# EAGLE design stereomix-back (EAGLE 9.0.1)
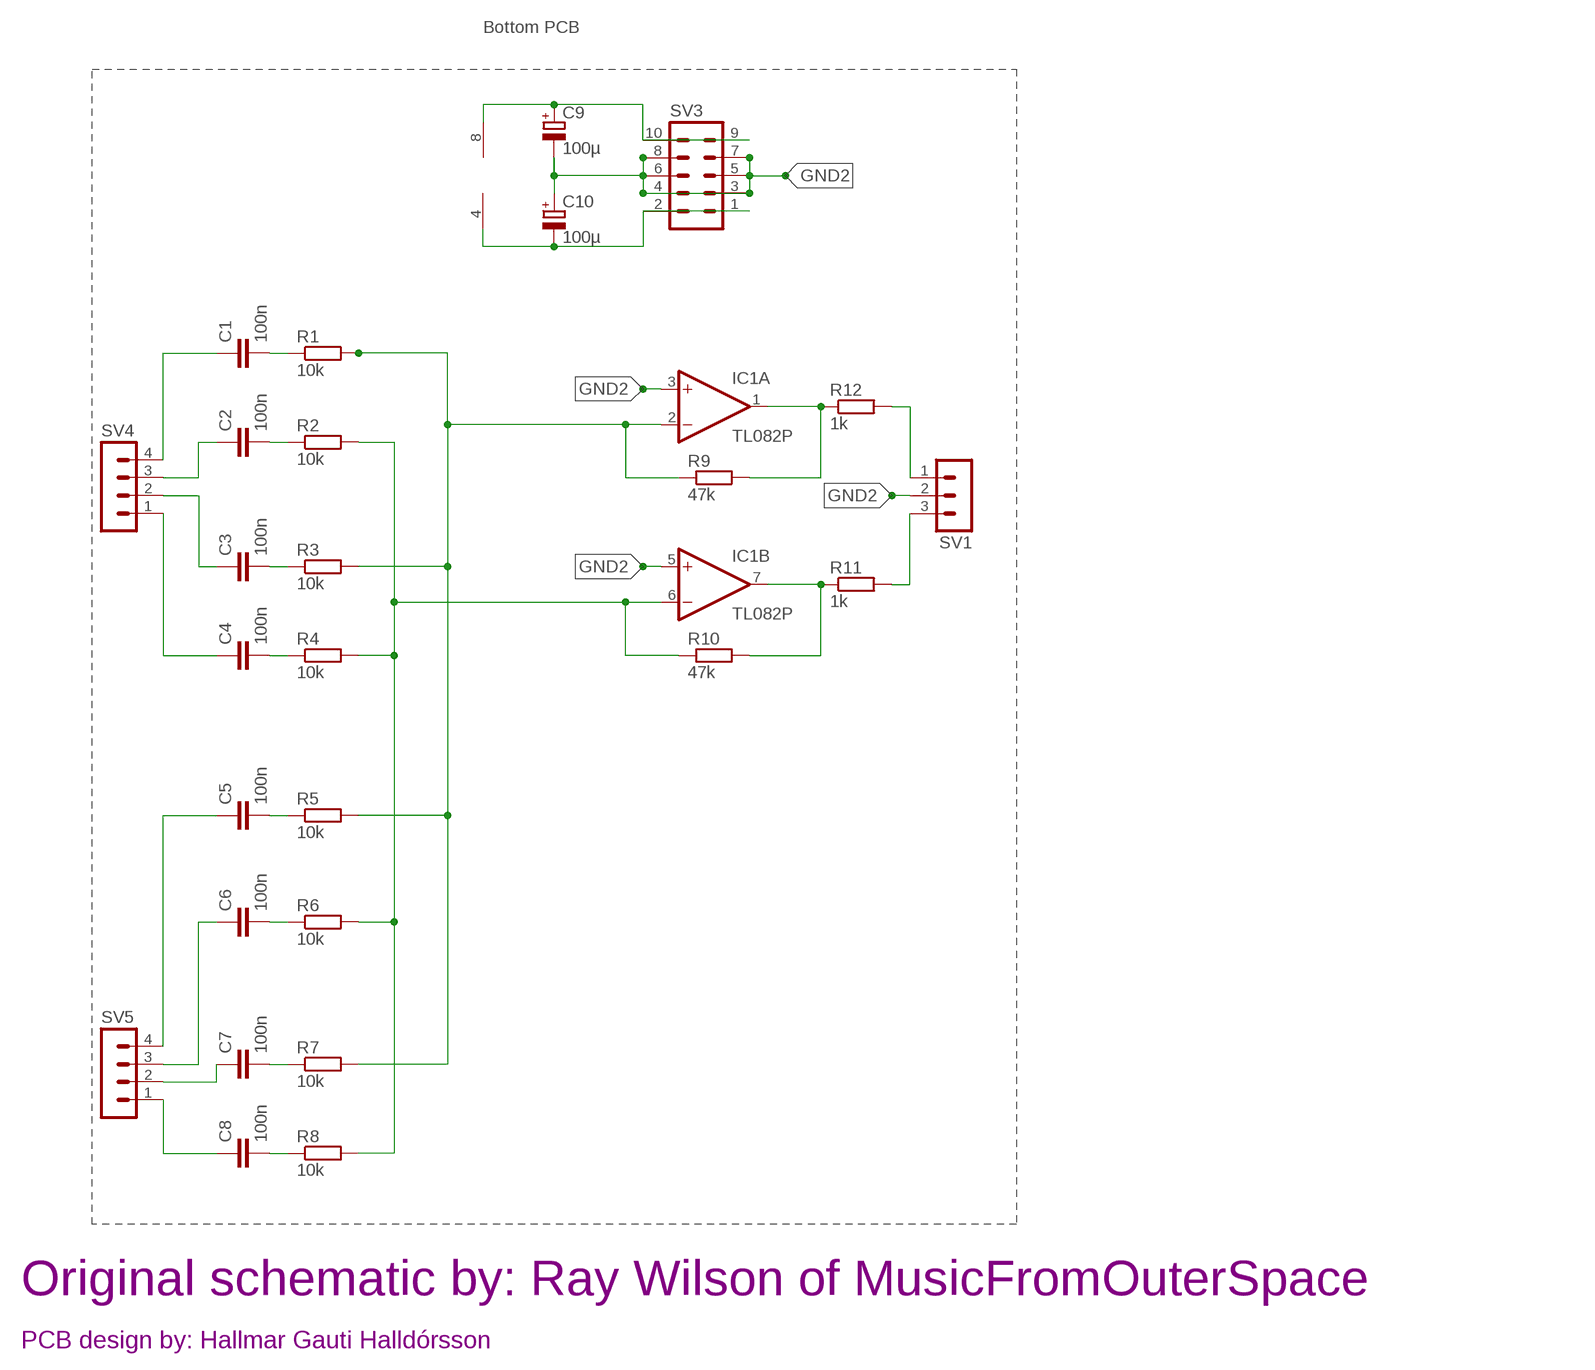
[diagram p0: schematic, sheet 1]

## Parts
C1  100n  C-EU050-024X044  [C050-024X044]
C2  100n  C-EU050-024X044  [C050-024X044]
C3  100n  C-EU050-024X044  [C050-024X044]
C4  100n  C-EU050-024X044  [C050-024X044]
C5  100n  C-EU050-024X044  [C050-024X044]
C6  100n  C-EU050-024X044  [C050-024X044]
C7  100n  C-EU050-024X044  [C050-024X044]
C8  100n  C-EU050-024X044  [C050-024X044]
C9  100µ  CPOL-EUE2.5-6  [E2,5-6]
C10  100µ  CPOL-EUE2,5-6E  [E2,5-6E]
IC1  TL082P  [DIL08]
R1  10k  R-EU_0204/7  [0204/7]
R2  10k  R-EU_0204/7  [0204/7]
R3  10k  R-EU_0204/7  [0204/7]
R4  10k  R-EU_0204/7  [0204/7]
R5  10k  R-EU_0204/7  [0204/7]
R6  10k  R-EU_0204/7  [0204/7]
R7  10k  R-EU_0204/7  [0204/7]
R8  10k  R-EU_0204/7  [0204/7]
R9  47k  R-EU_0204/7  [0204/7]
R10  47k  R-EU_0204/7  [0204/7]
R11  1k  R-EU_0204/7  [0204/7]
R12  1k  R-EU_0204/7  [0204/7]
SV1  MA03-1  [MA03-1]
SV3  MA05-2  [MA05-2]
SV4  MA04-1  [MA04-1]
SV5  MA04-1  [MA04-1]

## Nets
GND2: C9.- C10.+ IC1.3(A:+IN) IC1.5(B:+IN) SV1.2 SV3.3 SV3.4 SV3.5 SV3.6 SV3.7 SV3.8
N$1: IC1.2(A:-IN) R1.2 R3.2 R5.2 R7.2 R9.1
N$2: IC1.1(A:OUT) R9.2 R12.1
N$3: IC1.7(B:OUT) R10.2 R11.1
N$4: IC1.6(B:-IN) R2.2 R4.2 R6.2 R8.2 R10.1
N$5: R12.2 SV1.1
N$6: C1.2 R1.1
N$7: C2.2 R2.1
N$8: C3.2 R3.1
N$9: C4.2 R4.1
N$10: C5.2 R5.1
N$11: C6.2 R6.1
N$12: C7.2 R7.1
N$13: C8.2 R8.1
N$14: R11.2 SV1.3
N$15: C9.+ IC1.8(P:V+) SV3.9 SV3.10
N$16: C10.- IC1.4(P:V-) SV3.1 SV3.2
N$35: C8.1 SV5.1
N$36: C7.1 SV5.2
N$37: C6.1 SV5.3
N$38: C5.1 SV5.4
N$39: C4.1 SV4.1
N$40: C3.1 SV4.2
N$41: C2.1 SV4.3
N$42: C1.1 SV4.4

## Notes on the sheet
- Bottom PCB
- Original schematic by: Ray Wilson of MusicFromOuterSpace
- PCB design by: Hallmar Gauti Halldórsson

## Library data of the parts
C1-C8 = resistor:C-EU: CAPACITOR, European symbol
C9 C10 = resistor:CPOL-EU: POLARIZED CAPACITOR, European symbol
IC1 = linear:TL082: OP AMP Data sheet <http://www.ti.com/lit/ds/symlink/tl084a . pdf>; DATA_SHEET: <a href="http://www.ti.com/lit/ds/symlink/tl084a.pdf"> Data sheet </a>
R1-R12 = resistor:R-EU_: RESISTOR, European symbol
SV1 = con-lstb:MA03-1: PIN HEADER; OC_FARNELL: unknown; OC_NEWARK: unknown
SV3 = con-lstb:MA05-2: PIN HEADER; OC_FARNELL: unknown; OC_NEWARK: unknown
SV4 SV5 = con-lstb:MA04-1: PIN HEADER; OC_FARNELL: unknown; OC_NEWARK: unknown

## Board
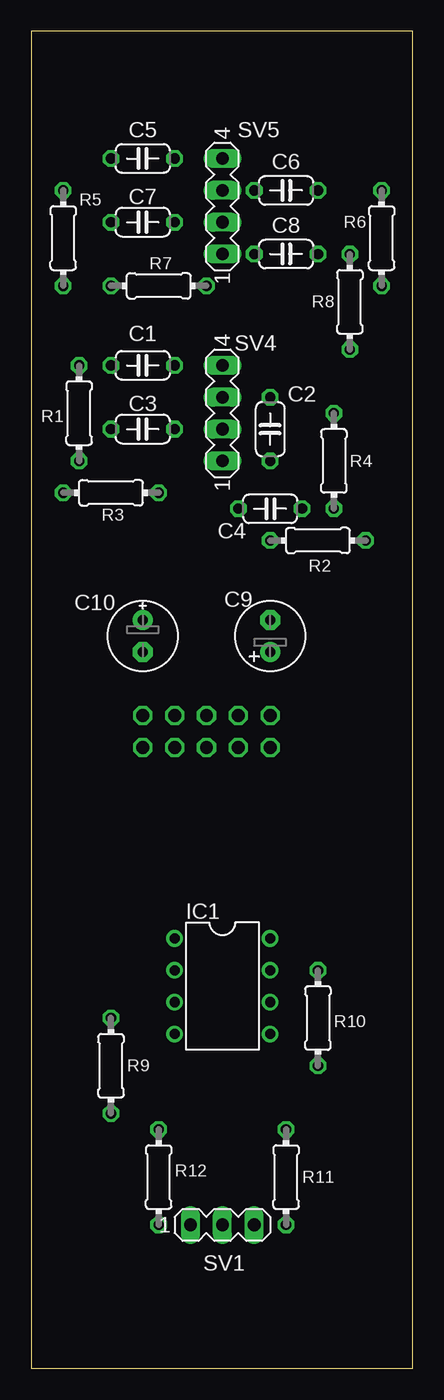
[diagram p1: board, top side]
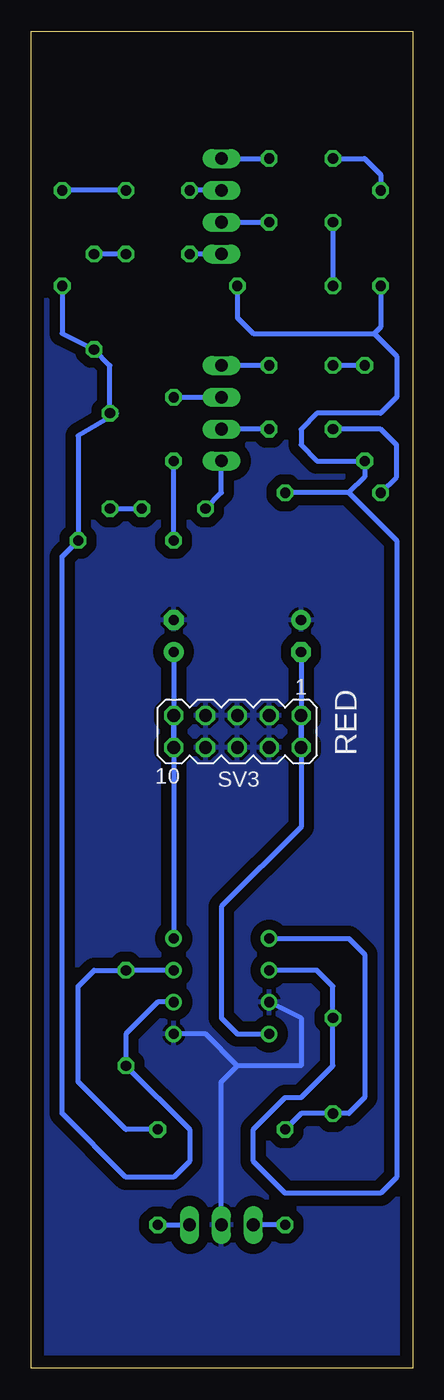
[diagram p2: board, bottom side, seen from below]

Size 30.4 x 106.67 mm. Coordinates in mm from the lower left corner, seen from the top.
Outline: 30.4,106.67 0,106.67 0,0 30.4,0 30.4,106.67
Copper layers (1*16): Top 0.035mm / dielectric 1.5mm / Bottom 0.035mm
Design rules "default": minimum track width 10mil, minimum drill 24mil, track to track 8mil, track to pad 8mil, pad to pad 8mil, via to via 8mil, smd to smd 8mil, copper to edge 40mil, drill to drill 8mil, minimum pad ring 10mil, minimum via ring 8mil, stop-mask expansion 4mil, vias tented up to drill 0mil, thermal gap 10mil

### Footprints (pad centres in the part's own frame; a part is rotated, then mirrored left to right if it is on the bottom)
C050-024X044 = drill 0.813 octagon: 1 -2.54,0; 2 2.54,0
E2,5-6 = drill 0.813 pad 1.6: + -1.27,0 | drill 0.813 pad 1.6 octagon: - 1.27,0
E2,5-6E = drill 0.813 pad 1.575: + -1.27,0 | drill 0.813 pad 1.575 octagon: - 1.27,0
DIL08 = drill 0.813 pad 1.27: 1 -3.81,-3.81; 2 -1.27,-3.81; 3 1.27,-3.81; 4 3.81,-3.81; 5 3.81,3.81; 6 1.27,3.81; 7 -1.27,3.81; 8 -3.81,3.81
0204/7 = drill 0.813 octagon: 1 -3.81,0; 2 3.81,0
MA03-1 = drill 1.016 long: 1 -2.54,0; 2 0,0; 3 2.54,0
MA05-2 = drill 1.016 octagon: 1 -5.08,-1.27; 2 -5.08,1.27; 3 -2.54,-1.27; 4 -2.54,1.27; 5 0,-1.27; 6 0,1.27; 7 2.54,-1.27; 8 2.54,1.27; 9 5.08,-1.27; 10 5.08,1.27
MA04-1 = drill 1.016 long: 1 -3.81,0; 2 -1.27,0; 3 1.27,0; 4 3.81,0

### Placement (x,y rotation side)
C1  8.89,80.01 180 top
C2  19.05,74.93 270 top
C3  8.89,74.93 180 top
C4  19.05,68.58 0 top
C5  8.89,96.52 180 top
C6  20.32,93.98 0 top
C7  8.89,91.44 180 top
C8  20.32,88.9 0 top
C9  19.05,58.42 90 top
C10  8.89,58.42 270 top
IC1  15.24,30.48 270 top
R1  3.81,76.2 270 top
R2  22.86,66.04 0 top
R3  6.35,69.85 0 top
R4  24.13,72.39 90 top
R5  2.54,90.17 270 top
R6  27.94,90.17 270 top
R7  10.16,86.36 0 top
R8  25.4,85.09 270 top
R9  6.35,24.13 270 top
R10  22.86,27.94 90 top
R11  20.32,15.24 270 top
R12  10.16,15.24 270 top
SV1  15.24,11.43 0 top
SV3  13.97,50.8 180 bottom
SV4  15.24,76.2 90 top
SV5  15.24,92.71 90 top

### Tracks (layer width: path | path; a pad name or v marks a point on that pad's centre or on a via)
GND2
  Bottom 0.406: IC1.3 8.89,27.94 8.89,24.13 13.97,24.13 | 13.97,24.13 16.51,26.67 IC1.5 | SV1.2 15.24,22.86 13.97,24.13
  pour Bottom (isolate 0.813): 0,106.68 30.48,106.68 30.48,0 0,0
N$1
  Bottom 0.406: R7.2 13.97,83.82 12.7,82.55 3.07,82.55 | 3.07,82.55 1.27,80.75 1.27,77.47 2.54,76.2 7.62,76.2 8.89,74.93 8.89,73.66 7.62,72.39 R1.2 3.81,71.12 5.08,69.85 | IC1.2 7.62,31.75 6.35,30.48 R9.1 6.35,24.13 8.89,21.59 10.16,21.59 12.7,19.05 12.7,16.51 10.16,13.97 2.54,13.97 1.27,15.24 1.27,66.04 5.08,69.85 | 5.08,69.85 R3.2 | 3.07,82.55 2.54,83.08 R5.2
N$2
  Bottom 0.406: R12.1 8.89,20.32 R9.2 5.08,20.32 3.81,21.59 3.81,33.02 5.08,34.29 IC1.1
N$3
  Bottom 0.406: R11.1 22.86,19.05 26.67,22.86 26.67,30.48 25.4,31.75 R10.2 IC1.7
N$4
  Bottom 0.406: R6.2 27.94,82.55 R8.2 24.13,80.01 R4.2 23.6,76.2 26.67,74.4 R2.2 27.94,64.77 27.94,20.32 22.86,15.24 19.05,15.24 17.78,16.51 17.78,19.05 R10.1 22.86,26.67 20.32,29.21 IC1.6
N$5
  Bottom 0.406: R12.2 SV1.1
N$6
  Bottom 0.406: R1.1 C1.2
N$7
  Bottom 0.406: R2.1 C2.2
N$8
  Bottom 0.406: R3.1 1.27,71.12 1.27,73.66 2.54,74.93 C3.2
N$9
  Bottom 0.406: R4.1 C4.2
N$10
  Bottom 0.406: C5.2 3.81,96.52 2.54,95.25 R5.1
N$11
  Bottom 0.406: C6.2 R6.1
N$12
  Bottom 0.406: C7.2 R7.1
N$13
  Bottom 0.406: C8.2 R8.1
N$14
  Bottom 0.406: R11.2 SV1.3
N$15
  Bottom 0.406: C9.+ SV3.9 | SV3.9 IC1.8 | SV3.10 SV3.9
N$16
  Bottom 0.406: C10.- SV3.1 | SV3.1 8.89,43.18 15.24,36.83 15.24,27.94 13.97,26.67 IC1.4 | SV3.2 SV3.1
N$35
  Bottom 0.406: SV5.1 C8.1
N$36
  Bottom 0.406: SV5.2 C7.1
N$37
  Bottom 0.406: SV5.3 C6.1
N$38
  Bottom 0.406: SV5.4 C5.1
N$39
  Bottom 0.406: C4.1 15.24,69.85 SV4.1
N$40
  Bottom 0.406: C3.1 SV4.2
N$41
  Bottom 0.406: C2.1 SV4.3
N$42
  Bottom 0.406: C1.1 SV4.4

### Text on the board
bNames: RED